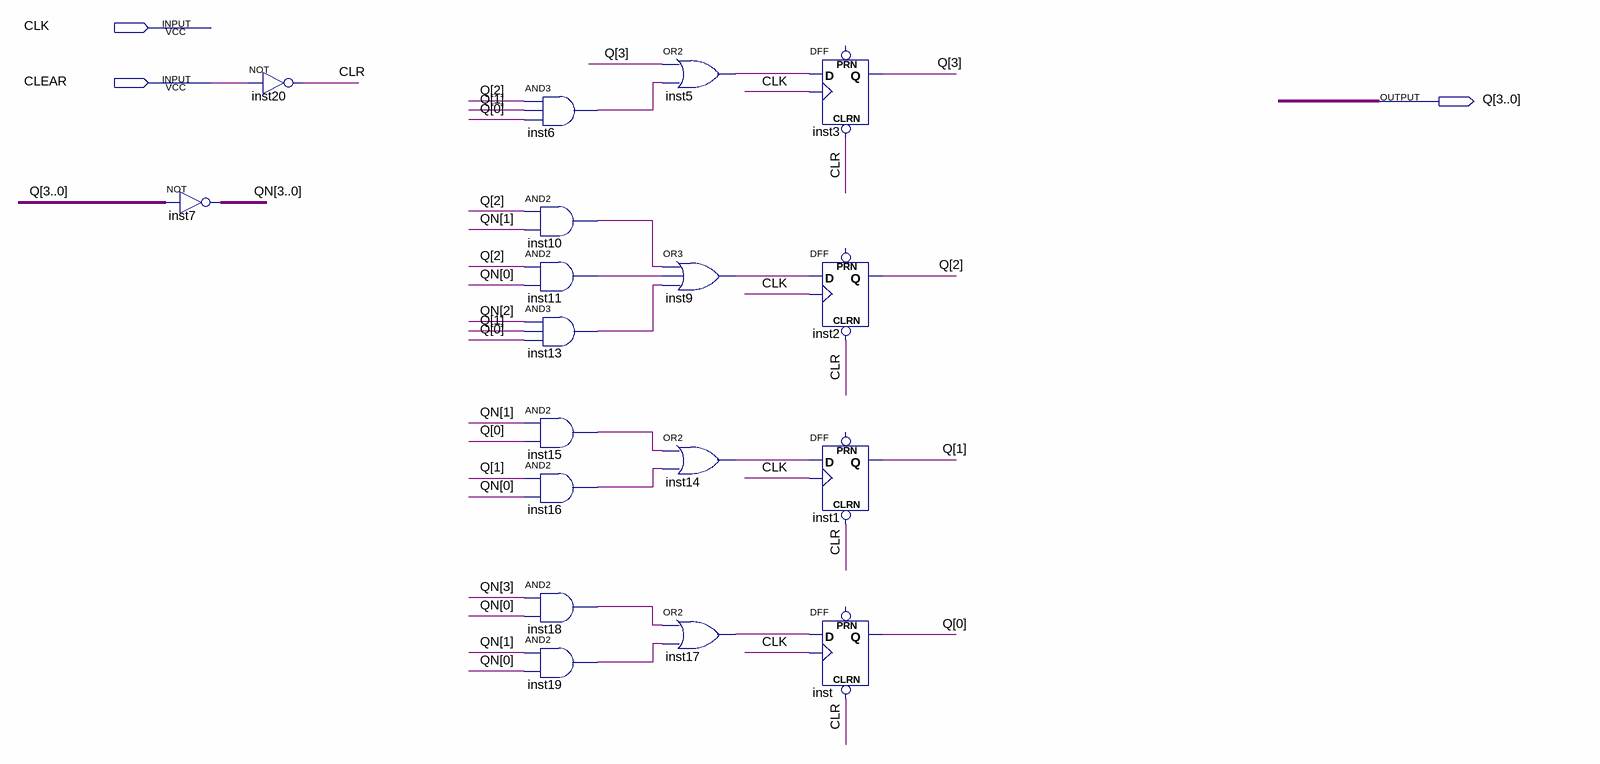
[diagram p0: schematic sheet]
// Quartus schematic D.bdf as structural Verilog: 18 symbols, 3 pins
module D (
  input  CLK,
  input  CLEAR,
  output [3:0] Q
);

  wire CLR, inst5_out, inst6_out, inst9_out, inst10_out, inst11_out, inst13_out, inst14_out, inst15_out,
       inst16_out, inst17_out, inst18_out, inst19_out;
  wire [3:0] QN;

  assign QN = ~Q;  // NOT inst7, 4 bits wide
  not inst20 (CLR, CLEAR);
  and inst6 (inst6_out, Q[2], Q[1], Q[0]);
  and inst10 (inst10_out, Q[2], QN[1]);
  and inst11 (inst11_out, Q[2], QN[0]);
  and inst13 (inst13_out, QN[2], Q[1], Q[0]);
  and inst15 (inst15_out, QN[1], Q[0]);
  and inst16 (inst16_out, Q[1], QN[0]);
  and inst18 (inst18_out, QN[3], QN[0]);
  and inst19 (inst19_out, QN[1], QN[0]);
  or inst5 (inst5_out, Q[3], inst6_out);
  or inst9 (inst9_out, inst10_out, inst11_out, inst13_out);
  or inst14 (inst14_out, inst15_out, inst16_out);
  or inst17 (inst17_out, inst18_out, inst19_out);
  DFF inst3 (.CLRN(CLR), .CLK(CLK), .D(inst5_out), .Q(Q[3]));  // open: PRN
  DFF inst2 (.CLRN(CLR), .CLK(CLK), .D(inst9_out), .Q(Q[2]));  // open: PRN
  DFF inst1 (.CLRN(CLR), .CLK(CLK), .D(inst14_out), .Q(Q[1]));  // open: PRN
  DFF inst (.CLRN(CLR), .CLK(CLK), .D(inst17_out), .Q(Q[0]));  // open: PRN
endmodule
